# EAGLE design AAA_Battery_Card (EAGLE 7.6.0)

## Sheet 1 of 2
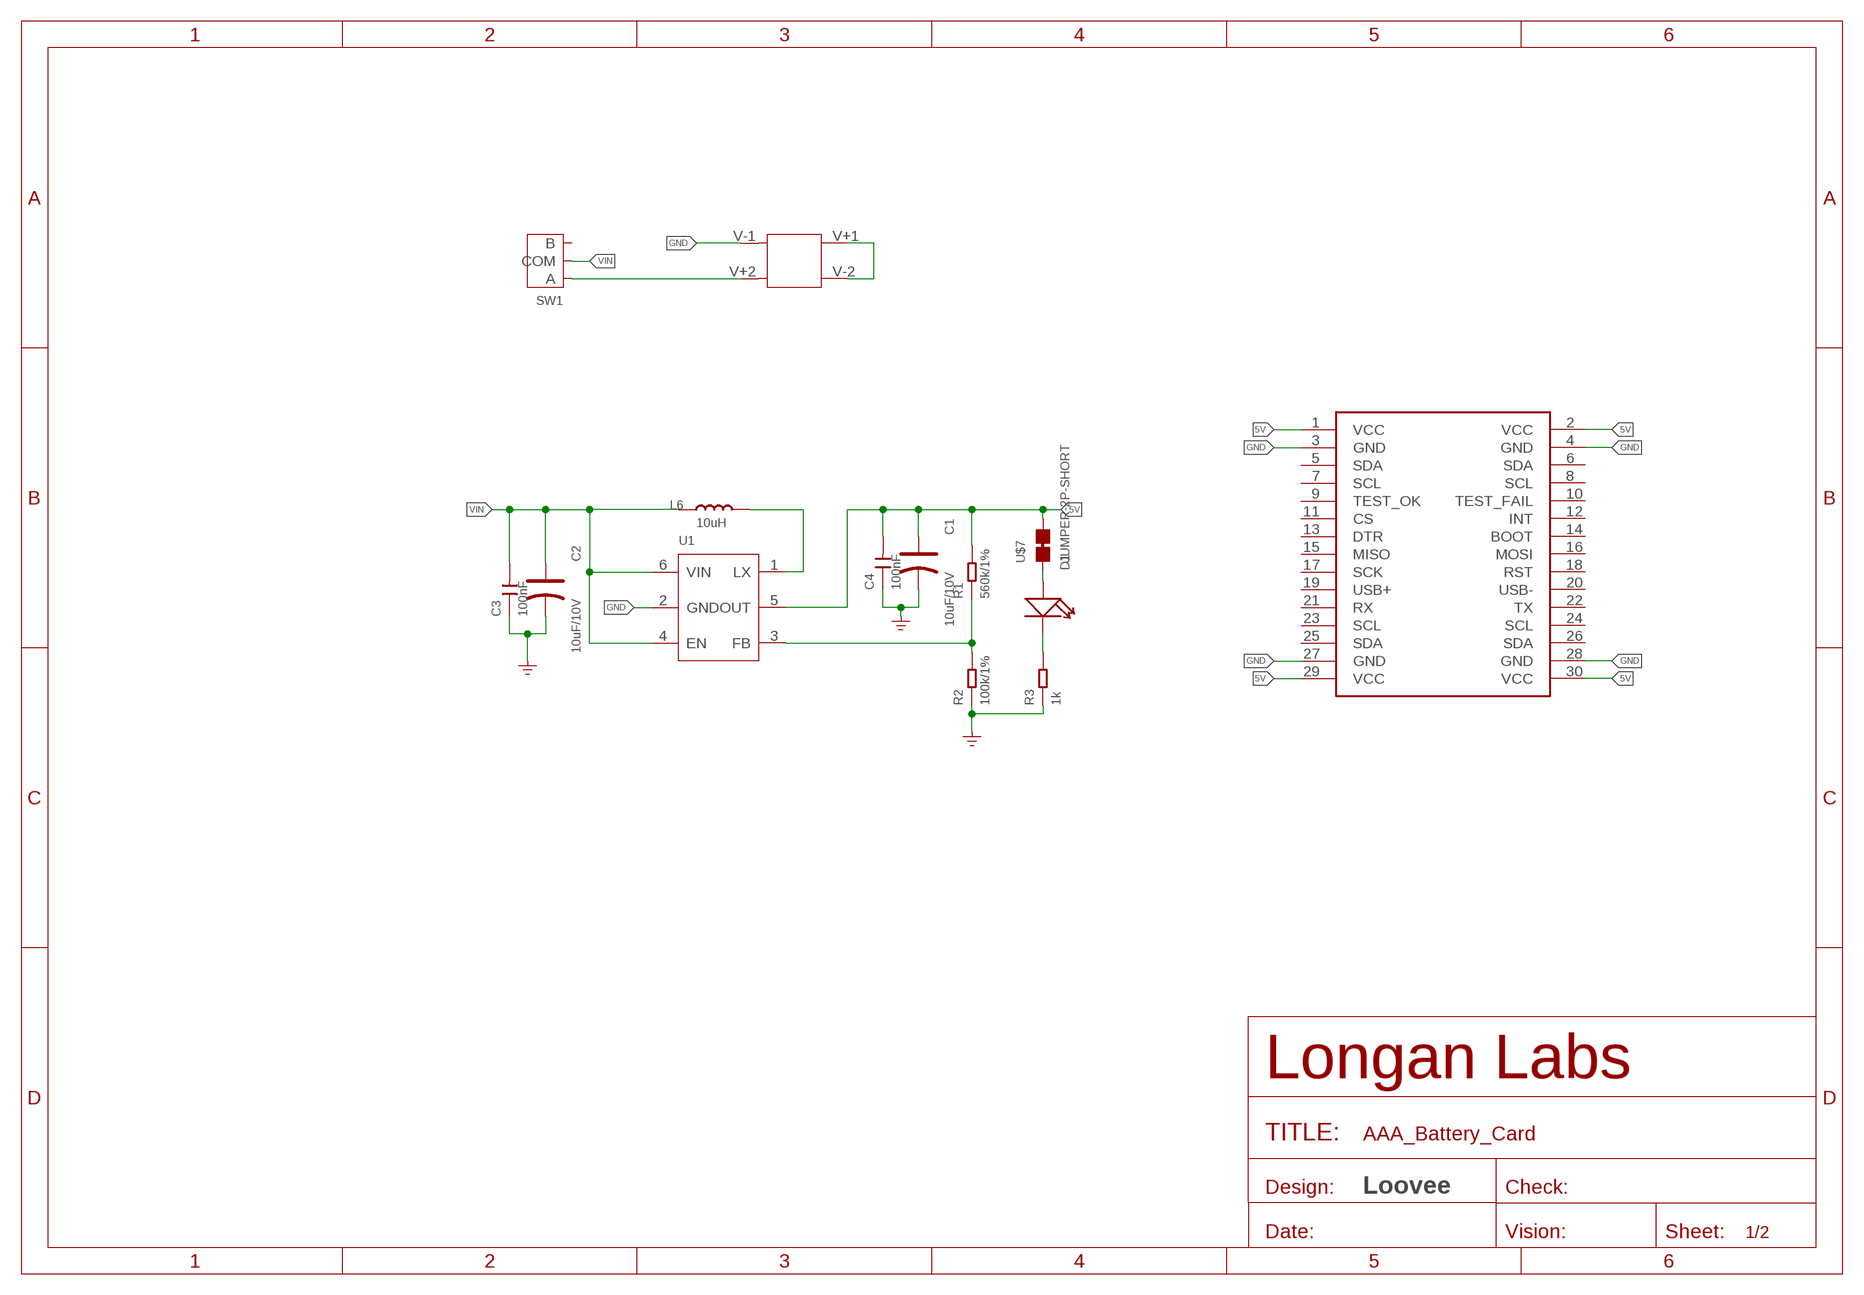
[diagram p0: schematic, sheet 1]

### Parts
BAT1  BAT-1.5VX2-HOLDER  [BAT-SMD-54.6X22.4MM]
C1  10uF/10V  CAP-POLAR-AVX-B  [AVX-B]
C2  10uF/10V  CAP-POLAR-AVX-B  [AVX-B]
C3  100nF  CAP-0603  [C0603]
C4  100nF  CAP-0603  [C0603]
D1  LED'0603'  [LED-0603]
L6  10uH  LSPD3D16-4R7M  [L0420]
MOUDLE1  MOUDLE-2X15P-2.54'BOARD'  [MOUDLE-2X15P-2.54]
R1  560k/1%  RES-0603  [R0603]
R2  100k/1%  RES-0603  [R0603]
R3  1k  RES-0603  [R0603]
SW1  SWITCH-2H-3P  [SW3-2.5-9X3.5MM]
U1  PMIC-PS7516  [SOT-23-6]
U$7  JUMPER-2P-SHORT  [2P-SMD-SHORT]

### Nets
5V: C1.+ C4.2 MOUDLE1.1(VCC) MOUDLE1.2(VCC) MOUDLE1.29(VCC) MOUDLE1.30(VCC) R1.2 U1.5(OUT) U$7.2
GND: BAT1.V-1 C1.- C2.- C3.1 C4.1 MOUDLE1.3(GND) MOUDLE1.4(GND) MOUDLE1.27(GND) MOUDLE1.28(GND) R2.1 R3.1 U1.2(GND) ; supply symbol labelled GND_POWER
N$1: BAT1.V+2 SW1.1(A)
N$2: BAT1.V+1 BAT1.V-2
N$3: D1.- R3.2
N$4: L6.2 U1.1(LX)
N$5: D1.+ U$7.1
N$7: R1.1 R2.2 U1.3(FB)
VIN: C2.+ C3.2 L6.1 SW1.2(COM) U1.4(EN) U1.6(VIN)
Unconnected: MOUDLE1.5(SDA) MOUDLE1.6(SDA) MOUDLE1.7(SCL) MOUDLE1.8(SCL) MOUDLE1.9(TEST_OK) MOUDLE1.10(TEST_FAIL) MOUDLE1.11(CS) MOUDLE1.12(INT) MOUDLE1.13(DTR) MOUDLE1.14(BOOT) MOUDLE1.15(MISO) MOUDLE1.16(MOSI) MOUDLE1.17(SCK) MOUDLE1.18(RST) MOUDLE1.19(USB+) MOUDLE1.20(USB-) MOUDLE1.21(RX) MOUDLE1.22(TX) MOUDLE1.23(SCL) MOUDLE1.24(SCL) MOUDLE1.25(SDA) MOUDLE1.26(SDA) SW1.3(B)

### Notes on the sheet
- Loovee

## Sheet 2 of 2

## Library data of the parts
BAT1 = Connector-new:BAT-1.5VX2-HOLDER
C1 C2 = Discrete-new:CAP-POLAR: Electrolytic Capacitors,Tantalum Capacitors and Super Capacitors
C3 C4 = Discrete-new:CAP: Ceramic Capacitors
D1 = Discrete-new:LED
L6 = Discrete-new:L
MOUDLE1 = Longan-moudle-big:MOUDLE-2X15P-2.54
R1-R3 = Discrete-new:RES
SW1 = SWITCH:SWITCH-2H-3P
U1 = Longan-IC:PMIC-PS7516
U$7 = Discrete-new:JUMPER-2P-SHORT

## Board
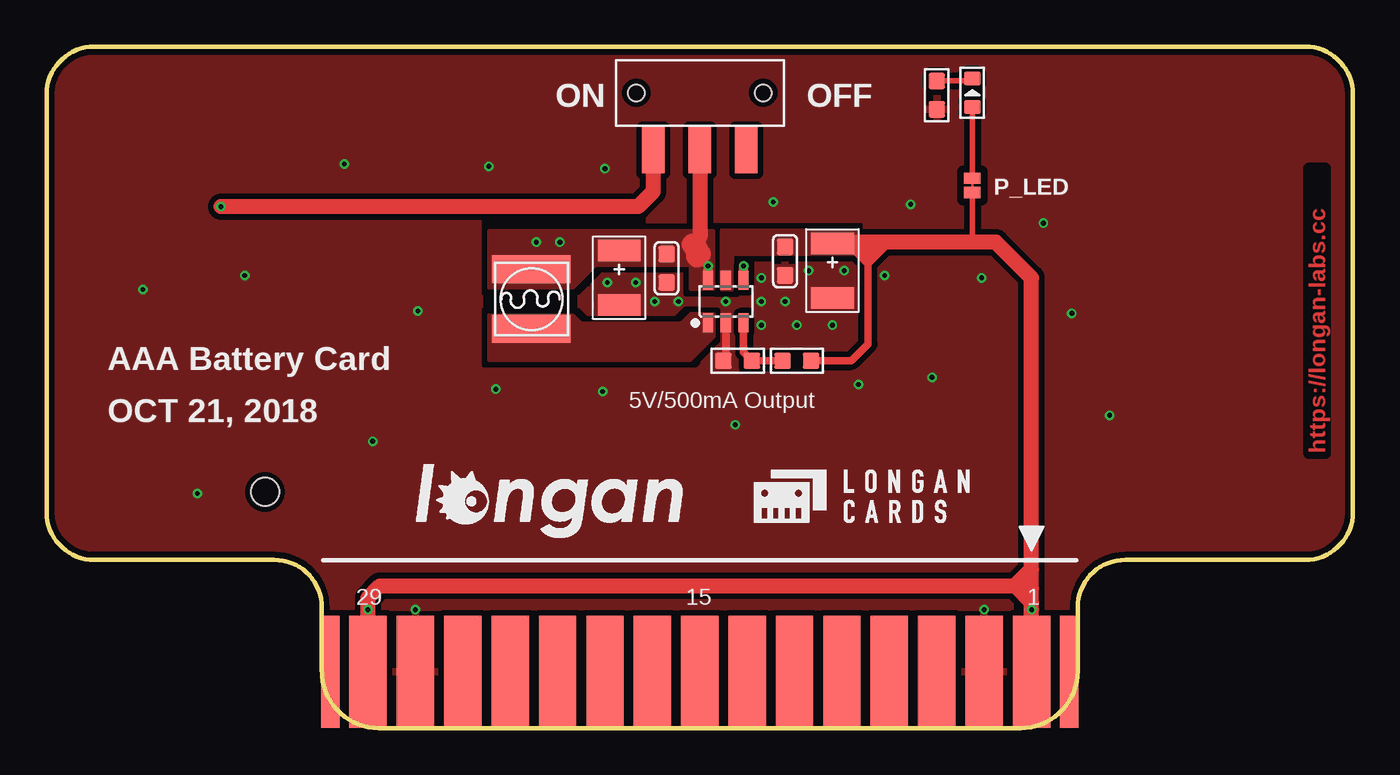
[diagram p1: board, top side]
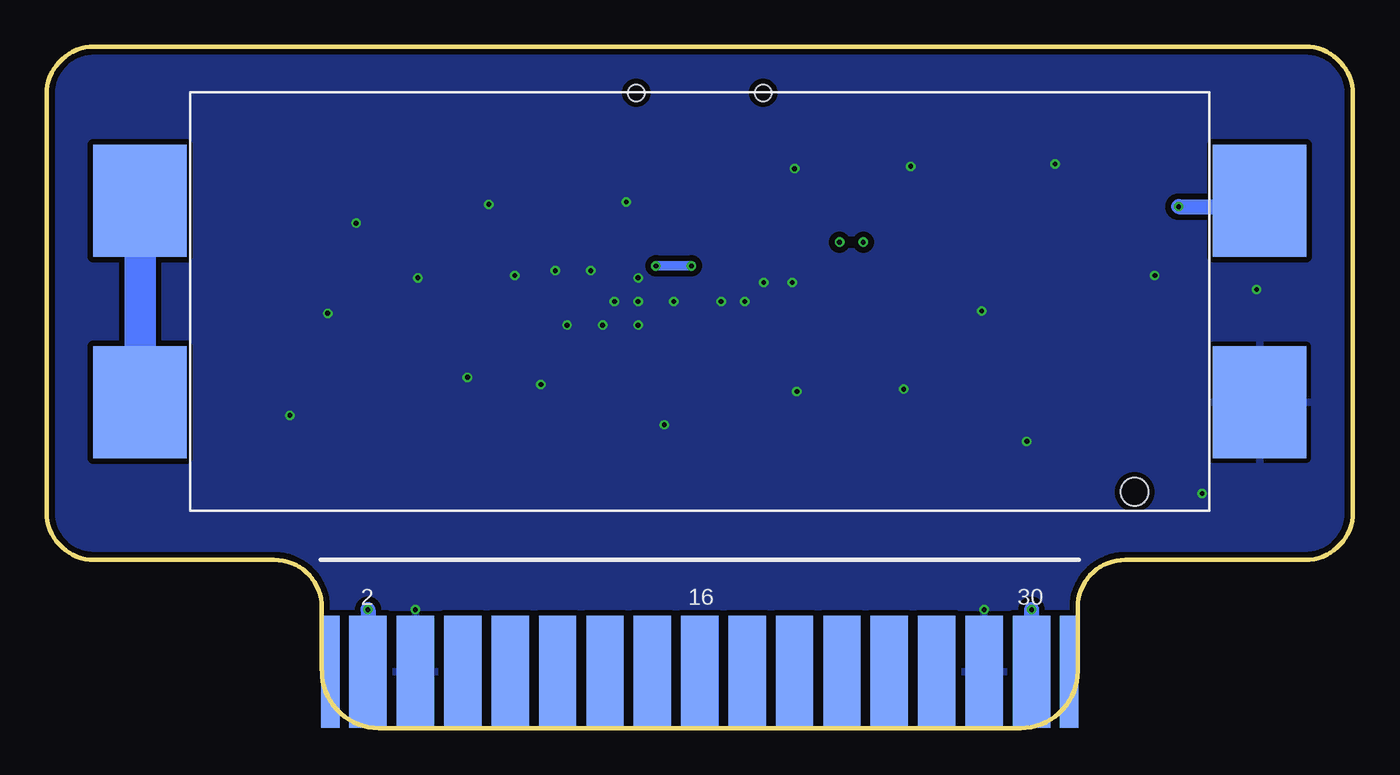
[diagram p2: board, bottom side, seen from below]

Size 70 x 36.5 mm. Coordinates in mm from the lower left corner, seen from the top.
Copper layers (1*16): Top 0.035mm / dielectric 1.5mm / Bottom 0.035mm
Design rules "SeeedStudio_2layer_DRU_no_angle_20140221": minimum track width 1mil, minimum drill 10mil, track to track 6mil, track to pad 6mil, pad to pad 6mil, via to via 6mil, smd to smd 0mil, copper to edge 10mil, drill to drill 10mil, minimum pad ring 4mil, minimum via ring 4mil, stop-mask expansion 2mil, vias tented up to drill 25mil, thermal gap 10mil
tRestrict: area 23.7,22.5 to 28.1,23.2

### Footprints (pad centres in the part's own frame; a part is rotated, then mirrored left to right if it is on the bottom)
BAT-SMD-54.6X22.4MM = smd 5 x 6: V+1 30,5.4; V+2 -30,-5.4; V-1 -30,5.4; V-2 30,-5.4 | hole 1.5: -23.3,10.2
AVX-B = smd 1.143 x 2.286: + -1.46,0; - 1.46,0
C0603 = smd 0.889 x 0.889: 1 0,0.762; 2 0,-0.762
LED-0603 = smd 0.762 x 0.889: + -0.762,0; - 0.762,0
L0420 = smd 1.5 x 4.2: 1 -1.6,0; 2 1.6,0
MOUDLE-2X15P-2.54 = smd 2 x 6: 1 17.78,-13.492; 3 15.24,-13.492; 5 12.7,-13.492; 7 10.16,-13.492; 9 7.62,-13.492; 11 5.08,-13.492; 13 2.54,-13.492; 15 0,-13.492; 17 -2.54,-13.492; 19 -5.08,-13.492; 21 -7.62,-13.492; 23 -10.16,-13.492; 25 -12.7,-13.492; 27 -15.24,-13.492; 29 -17.78,-13.492 | smd 2 x 6 bottom: 2 17.78,-13.492; 4 15.24,-13.492; 6 12.7,-13.492; 8 10.16,-13.492; 10 7.62,-13.492; 12 5.08,-13.492; 14 2.54,-13.492; 16 0,-13.492; 18 -2.54,-13.492; 20 -5.08,-13.492; 22 -7.62,-13.492; 24 -10.16,-13.492; 26 -12.7,-13.492; 28 -15.24,-13.492; 30 -17.78,-13.492 | smd 1 x 6: P1 -19.8,-13.492; P4 19.8,-13.492 | smd 1 x 6 bottom: P2 -19.8,-13.492; P3 19.8,-13.492
R0603 = smd 0.889 x 0.889: 1 0,0.762; 2 0,-0.762
SW3-2.5-9X3.5MM = smd 1.2 x 2.45: 1 -2.5,-3.075; 2 0,-3.075; 3 2.5,-3.075 | hole 0.9: -3.4,0; 3.4,0
SOT-23-6 = smd 0.55 x 1.016: 1 -0.95,-1.143; 2 0,-1.143; 3 0.95,-1.143; 4 0.95,1.143; 5 0,1.143; 6 -0.95,1.143
2P-SMD-SHORT = smd 0.889 x 0.61: 1 0,0.381; 2 0,-0.381

### Placement (x,y rotation side)
BAT1  35,22.85 180 bottom
C1  42.11,24.5 270 top
C2  30.68,24.12 270 top
C3  33.22,24.63 180 top
C4  39.57,25.01 180 top
D1  49.61,34.03 90 top
L6  25.98,22.98 270 top
MOUDLE1  35,16.5 0 top
R1  40.21,19.68 90 top
R2  37.03,19.68 90 top
R3  47.7,33.9 180 top
SW1  35,34.03 0 top
U1  36.4,22.85 0 top
U$1  [LONGAN-CARDS-SMALL]  37.41,10.66 0 top
U$6  [LONGAN-SILK-SMALLER]  18.49,9.01 0 top
U$7  49.61,29.07 0 top

### Tracks (layer width: path | path; a pad name or v marks a point on that pad's centre or on a via)
5V  (via drill 0.25 pad 0.51)
  Top 0.305: U$7.2 49.61,26.15 49.48,26.02
  Top 0.406: R1.2 43.13,19.68 44.02,20.56 44.02,24.88 | 44.02,24.88 44.02,25.26 | 44.02,25.26 44.02,25.39 | 44.02,25.39 44.02,25.9 43.89,26.02 | 43,25.77 42.3,25.77 C1.+ | 44.02,24.88 42.87,26.02 | 44.02,24.88 45.16,26.02 | 44.02,25.26 43.51,25.77 | 44.02,25.39 44.14,25.39 44.52,25.77
  Top 0.813: MOUDLE1.2 v52.78,6.34 52.78,6.72 | 52.78,6.72 52.78,7.48 | 52.78,7.48 52.78,8.5 | 52.78,8.5 52.78,24.12 50.88,26.02 49.48,26.02 45.16,26.02 43.89,26.02 42.87,26.02 42.18,26.02 C1.+ | MOUDLE1.30 v17.22,6.34 17.22,6.97 17.86,7.61 51.89,7.61 | 51.89,7.61 52.65,7.61 52.78,7.48 | 51.89,7.61 52.78,8.5 | 51.89,7.61 52.78,6.72
  Bottom 0.813: v17.22,6.34 MOUDLE1.30 | v52.78,6.34 MOUDLE1.2
  pour Top (isolate 0.254, no thermals): 36.14,23.48 36.78,23.48 36.78,25.39 43.38,25.39 43.38,26.66 36.14,26.66
GND  (via drill 0.25 pad 0.51)
  Top 0.406: U1.2 36.4,19.8 R2.1
  other vias: 19.76,6.34 50.24,6.34 36.4,22.85 32.59,22.85 31.57,23.87 30.05,23.87 33.86,22.85 38.3,24.12 42.11,21.58 40.21,21.58 38.3,21.58 39.57,22.85 42.75,24.5 40.84,24.5 38.3,22.85 15.95,30.22 23.7,30.09 29.92,29.96 38.94,28.18 46.3,28.06 44.91,24.25 50.11,24.12 53.41,27.04 54.94,22.21 47.45,18.79 43.51,18.41 36.91,16.25 29.79,18.02 24.08,18.15 19.89,22.34 10.62,24.25 8.08,12.56 17.47,15.36 5.16,23.48 56.97,16.75
  pour Top (isolate 0.305, rank 6): -0.69,36.69 70.69,36.69 70.69,0.88 70.69,-1.41 -0.69,-1.41
  pour Bottom (isolate 0.305): -0.69,36.69 70.69,36.69 70.69,0.88 70.69,-1.41 -0.69,-1.41
  pour Top (isolate 0.305, rank 6, no thermals): 29.41,24.76 29.41,20.95 44.27,20.95 44.27,24.76
  pour Top (isolate 0.254, rank 6, no thermals): 35.13,22.85 37.03,22.85 37.03,18.53 35.13,18.53
N$1  (via drill 0.25 pad 0.51)
  Top 0.813: SW1.1 32.5,28.73 31.7,27.93 v9.35,27.93
  Bottom 0.813: v9.35,27.93 5.66,27.93 5.54,28.06 5.19,28.06 BAT1.V+2
N$2
  Bottom 1.676: BAT1.V+1 BAT1.V-2
N$3
  Top 0.305: R3.2 49.48,34.66 D1.-
N$4
  pour Top (isolate 0.254, no thermals): 34.49,22.21 35.76,22.21 35.76,20.95 34.49,19.68 23.7,19.68 23.7,22.21 28.14,22.21 28.65,21.71 33.98,21.71
N$5
  Top 0.305: D1.+ U$7.1
N$7
  Top 0.406: U1.3 37.35,20.12 R2.2 R1.1
VIN  (via drill 0.25 pad 0.51)
  Top 0.508: U1.4 v37.35,24.75 v37.35,24.76 | v35.45,24.76 U1.6
  Top 0.813: SW1.2 35,26.28 34.62,25.9
  Top 1.168: 35,25.39 34.87,25.26 34.87,25.64 34.62,25.9
  Bottom 0.508: v37.35,24.76 v35.45,24.76
  other vias: 26.24,26.02 27.51,26.02
  pour Top (isolate 0.254, rank 2, no thermals): 23.7,26.66 35.76,26.66 35.76,23.48 34.49,23.48 34.49,24.76 29.41,24.76 28.14,23.48 23.7,23.48

### Text on the board
Top: https://longan-labs.cc
tPlace: ON | OFF | P_LED | AAA Battery Card | 5V/500mA Output | OCT 21, 2018